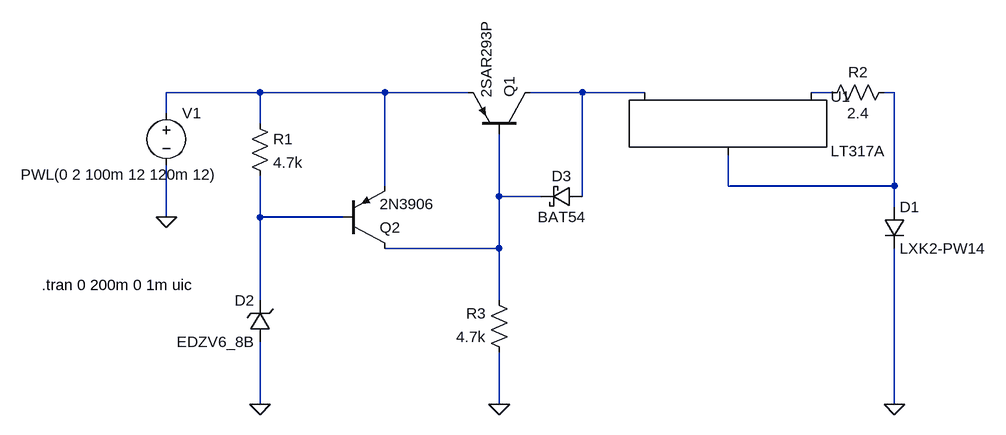
[diagram p0: schematic Draft1.asc]
Draft1.asc, the LTspice schematic file:
Version 4.1
SHEET 1 1012 680
WIRE -112 -16 -256 -16
WIRE 80 -16 -112 -16
WIRE 208 -16 80 -16
WIRE 384 -16 304 -16
WIRE 480 -16 384 -16
WIRE 768 -16 736 -16
WIRE 864 -16 848 -16
WIRE -256 16 -256 -16
WIRE -112 32 -112 -16
WIRE 80 128 80 -16
WIRE 608 128 608 80
WIRE 864 128 864 -16
WIRE 864 128 608 128
WIRE 256 144 256 48
WIRE 320 144 256 144
WIRE 384 144 384 -16
WIRE 864 160 864 128
WIRE -256 176 -256 96
WIRE -112 176 -112 112
WIRE 16 176 -112 176
WIRE 256 224 256 144
WIRE 256 224 80 224
WIRE -112 304 -112 176
WIRE 256 304 256 224
WIRE -112 464 -112 368
WIRE 256 464 256 384
WIRE 864 464 864 224
FLAG -256 176 0
FLAG -112 464 0
FLAG 256 464 0
FLAG 864 464 0
SYMBOL diode 848 160 R0
SYMATTR InstName D1
SYMATTR Value LXK2-PW14
SYMATTR Description Diode
SYMATTR Type diode
SYMBOL zener -96 368 R180
WINDOW 0 24 64 Left 2
WINDOW 3 24 0 Left 2
SYMATTR InstName D2
SYMATTR Value EDZV6_8B
SYMBOL pnp 304 48 M270
SYMATTR InstName Q1
SYMATTR Value 2SAR293P
SYMBOL pnp 16 224 M180
SYMATTR InstName Q2
SYMATTR Value 2N3906
SYMBOL res -128 16 R0
SYMATTR InstName R1
SYMATTR Value 4.7k
SYMBOL res 864 -32 R90
WINDOW 0 0 56 VBottom 2
WINDOW 3 32 56 VTop 2
SYMATTR InstName R2
SYMATTR Value 2.4
SYMBOL res 272 400 R180
WINDOW 0 36 76 Left 2
WINDOW 3 36 40 Left 2
SYMATTR InstName R3
SYMATTR Value 4.7k
SYMBOL PowerProducts\\LT317A 608 -16 R0
SYMATTR InstName U1
SYMBOL schottky 384 128 R90
WINDOW 0 0 32 VBottom 2
WINDOW 3 32 32 VTop 2
SYMATTR InstName D3
SYMATTR Value BAT54
SYMBOL voltage -256 0 R0
WINDOW 3 -224 110 Left 2
WINDOW 123 0 0 Left 0
WINDOW 39 0 0 Left 0
SYMATTR InstName V1
SYMATTR Value PWL(0 2 100m 12 120m 12)
TEXT -448 280 Left 2 !.tran 0 200m 0 1m uic

The netlist it stands for:
* Draft1.asc
D1 N004 0 LXK2-PW14
D2 0 N006 EDZV6_8B
Q1 N002 N005 N001 0 2SAR293P
Q2 N005 N006 N001 0 2N3906
R1 N001 N006 4.7k
R2 N004 N003 2.4
R3 0 N005 4.7k
X§U1 N004 N003 N002 LT317A
D3 N002 N005 BAT54
V1 N001 0 PWL(0 2 100m 12 120m 12)
.model D D
.lib standard.dio
.model NPN NPN
.model PNP PNP
.lib standard.bjt
.tran 0 200m 0 1m uic
.lib LTC.lib
.backanno
.end